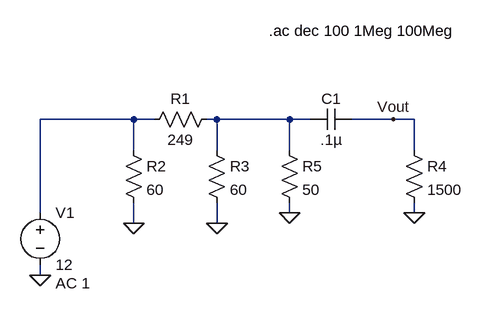
[diagram p0: schematic Resistive Pad.asc]
Resistive Pad.asc, the LTspice schematic file:
Version 4
SHEET 1 1672 756
WIRE 32 -32 -112 -32
WIRE 64 -32 32 -32
WIRE 160 -32 144 -32
WIRE 272 -32 160 -32
WIRE 304 -32 272 -32
WIRE 432 -32 368 -32
WIRE 464 -32 432 -32
WIRE 32 16 32 -32
WIRE 160 16 160 -32
WIRE 272 16 272 -32
WIRE 464 16 464 -32
WIRE -112 112 -112 -32
WIRE 272 112 272 96
WIRE 464 112 464 96
WIRE 32 128 32 96
WIRE 160 128 160 96
WIRE -112 208 -112 192
FLAG -112 208 0
FLAG 32 128 0
FLAG 160 128 0
FLAG 464 112 0
FLAG 432 -32 Vout
FLAG 272 112 0
SYMBOL voltage -112 96 R0
WINDOW 123 24 124 Left 2
WINDOW 39 0 0 Left 2
SYMATTR Value2 AC 1
SYMATTR InstName V1
SYMATTR Value 12
SYMBOL res 160 -48 R90
WINDOW 0 0 56 VBottom 2
WINDOW 3 32 56 VTop 2
SYMATTR InstName R1
SYMATTR Value 249
SYMBOL res 16 0 R0
SYMATTR InstName R2
SYMATTR Value 60
SYMBOL res 144 0 R0
SYMATTR InstName R3
SYMATTR Value 60
SYMBOL cap 368 -48 R90
WINDOW 0 0 32 VBottom 2
WINDOW 3 32 32 VTop 2
SYMATTR InstName C1
SYMATTR Value .1µ
SYMBOL res 448 0 R0
SYMATTR InstName R4
SYMATTR Value 1500
SYMBOL res 256 0 R0
SYMATTR InstName R5
SYMATTR Value 50
TEXT 240 -168 Left 2 !.ac dec 100 1Meg 100Meg

The netlist it stands for:
* Resistive Pad.asc
V1 N001 0 12 AC 1
R1 N002 N001 249
R2 N001 0 60
R3 N002 0 60
C1 Vout N002 .1µ
R4 Vout 0 1500
R5 N002 0 50
.ac dec 100 1Meg 100Meg
.backanno
.end